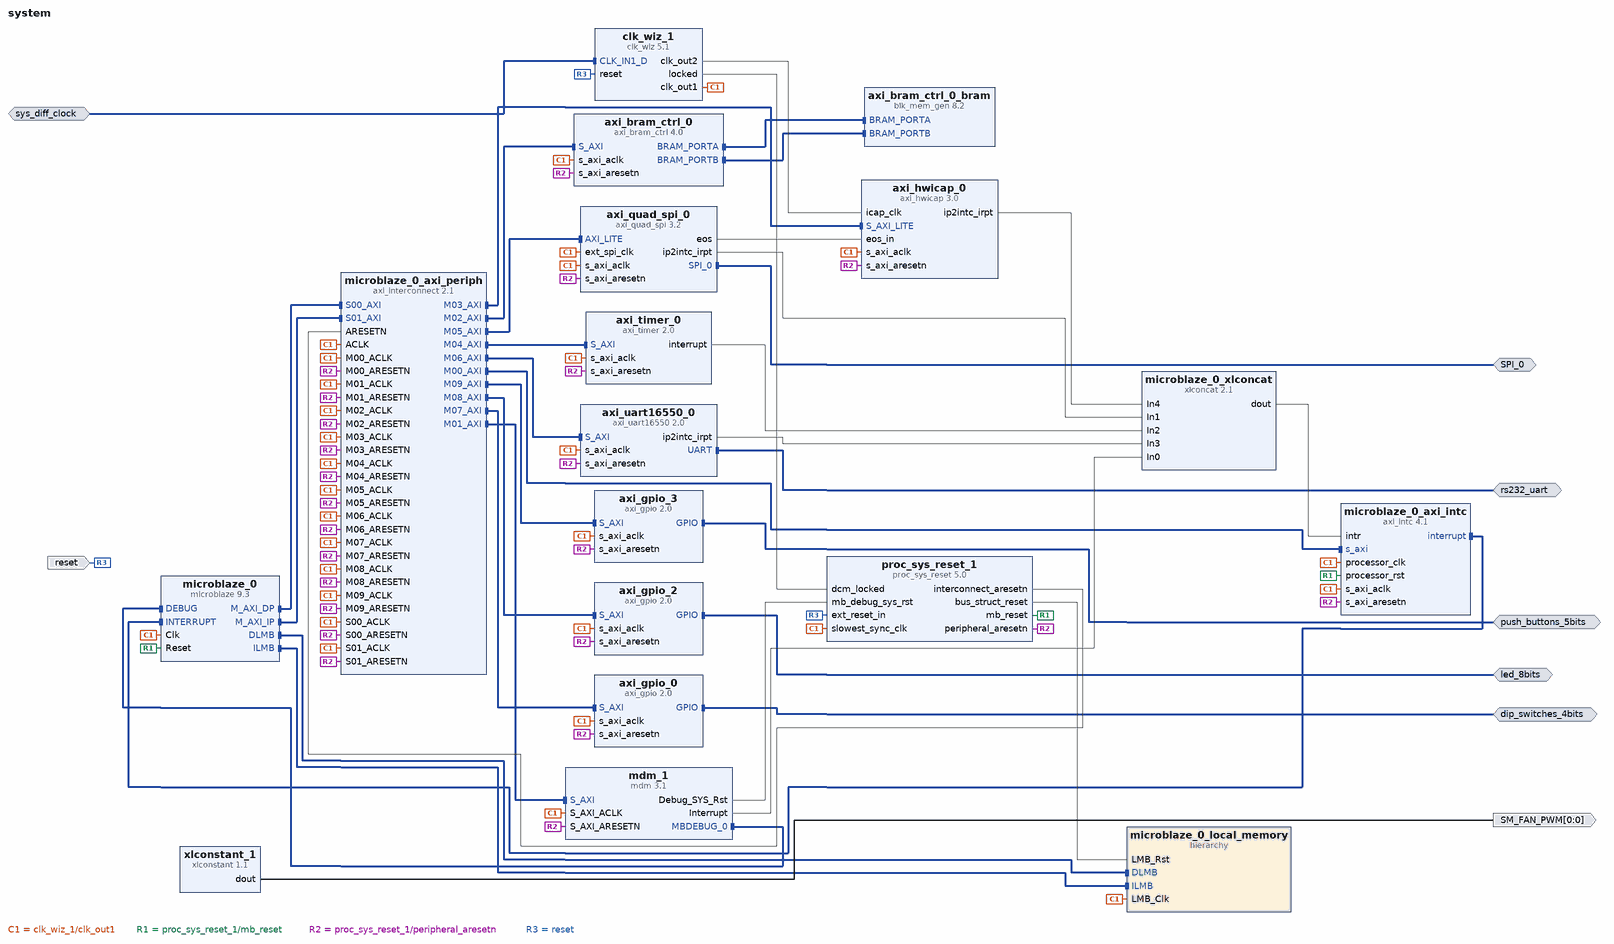
[diagram p0: block diagram of the top level]
# Vivado block design system, Vivado 2014.2
create_bd_design system

create_bd_intf_port -mode Master -vlnv xilinx.com:interface:spi_rtl:1.0 SPI_0
create_bd_intf_port -mode Master -vlnv xilinx.com:interface:gpio_rtl:1.0 dip_switches_4bits
create_bd_intf_port -mode Master -vlnv xilinx.com:interface:gpio_rtl:1.0 led_8bits
create_bd_intf_port -mode Master -vlnv xilinx.com:interface:gpio_rtl:1.0 push_buttons_5bits
create_bd_intf_port -mode Master -vlnv xilinx.com:interface:uart_rtl:1.0 rs232_uart
create_bd_intf_port -mode Slave -vlnv xilinx.com:interface:diff_clock_rtl:1.0 sys_diff_clock
set_property -dict {CONFIG.FREQ_HZ 200000000} [get_bd_intf_ports sys_diff_clock]
create_bd_port -dir I -type rst reset
set_property -dict {CONFIG.POLARITY ACTIVE_HIGH} [get_bd_ports reset]
create_bd_port -dir O -from 0 -to 0 SM_FAN_PWM

create_bd_cell -type ip -vlnv xilinx.com:ip:axi_bram_ctrl:4.0 axi_bram_ctrl_0
create_bd_cell -type ip -vlnv xilinx.com:ip:blk_mem_gen:8.2 axi_bram_ctrl_0_bram
set_property -dict {CONFIG.Memory_Type True_Dual_Port_RAM} [get_bd_cells axi_bram_ctrl_0_bram]
create_bd_cell -type ip -vlnv xilinx.com:ip:axi_gpio:2.0 axi_gpio_0
set_property -dict {CONFIG.USE_BOARD_FLOW true CONFIG.GPIO_BOARD_INTERFACE dip_switches_4bits} [get_bd_cells axi_gpio_0]
create_bd_cell -type ip -vlnv xilinx.com:ip:axi_gpio:2.0 axi_gpio_2
set_property -dict {CONFIG.USE_BOARD_FLOW true CONFIG.GPIO_BOARD_INTERFACE led_8bits} [get_bd_cells axi_gpio_2]
create_bd_cell -type ip -vlnv xilinx.com:ip:axi_gpio:2.0 axi_gpio_3
set_property -dict {CONFIG.USE_BOARD_FLOW true CONFIG.GPIO_BOARD_INTERFACE push_buttons_5bits} [get_bd_cells axi_gpio_3]
create_bd_cell -type ip -vlnv xilinx.com:ip:axi_hwicap:3.0 axi_hwicap_0
set_property -dict {CONFIG.C_INCLUDE_STARTUP 0} [get_bd_cells axi_hwicap_0]
create_bd_cell -type ip -vlnv xilinx.com:ip:axi_quad_spi:3.2 axi_quad_spi_0
set_property -dict [list \
  CONFIG.C_SPI_MODE 2 \
  CONFIG.C_XIP_MODE 0 \
  CONFIG.USE_BOARD_FLOW true \
  CONFIG.QSPI_BOARD_INTERFACE spi_flash \
] [get_bd_cells axi_quad_spi_0]
create_bd_cell -type ip -vlnv xilinx.com:ip:axi_timer:2.0 axi_timer_0
create_bd_cell -type ip -vlnv xilinx.com:ip:axi_uart16550:2.0 axi_uart16550_0
set_property -dict {CONFIG.USE_BOARD_FLOW true CONFIG.UART_BOARD_INTERFACE rs232_uart} [get_bd_cells axi_uart16550_0]
create_bd_cell -type ip -vlnv xilinx.com:ip:clk_wiz:5.1 clk_wiz_1
set_property -dict [list \
  CONFIG.CLKOUT2_USED true \
  CONFIG.CLKOUT2_REQUESTED_OUT_FREQ 50.000 \
  CONFIG.USE_BOARD_FLOW true \
  CONFIG.DIFF_CLK_IN1_BOARD_INTERFACE sys_diff_clock \
  CONFIG.RESET_BOARD_INTERFACE reset \
] [get_bd_cells clk_wiz_1]
create_bd_cell -type ip -vlnv xilinx.com:ip:mdm:3.1 mdm_1
set_property -dict {CONFIG.C_USE_UART 1} [get_bd_cells mdm_1]
create_bd_cell -type ip -vlnv xilinx.com:ip:microblaze:9.3 microblaze_0
set_property -dict [list \
  CONFIG.C_FAULT_TOLERANT 0 \
  CONFIG.C_D_AXI 1 \
  CONFIG.C_D_LMB 1 \
  CONFIG.C_I_AXI 1 \
  CONFIG.C_I_LMB 1 \
  CONFIG.C_USE_BARREL 1 \
  CONFIG.C_DEBUG_ENABLED 1 \
  CONFIG.C_USE_INTERRUPT 2 \
] [get_bd_cells microblaze_0]
create_bd_cell -type ip -vlnv xilinx.com:ip:axi_intc:4.1 microblaze_0_axi_intc
set_property -dict {CONFIG.C_HAS_FAST 1} [get_bd_cells microblaze_0_axi_intc]
create_bd_cell -type ip -vlnv xilinx.com:ip:axi_interconnect:2.1 microblaze_0_axi_periph
set_property -dict {CONFIG.NUM_SI 2 CONFIG.NUM_MI 10} [get_bd_cells microblaze_0_axi_periph]
create_bd_cell -type hier microblaze_0_local_memory
create_bd_cell -type ip -vlnv xilinx.com:ip:xlconcat:2.1 microblaze_0_xlconcat
set_property -dict {CONFIG.NUM_PORTS 5} [get_bd_cells microblaze_0_xlconcat]
create_bd_cell -type ip -vlnv xilinx.com:ip:proc_sys_reset:5.0 proc_sys_reset_1
set_property -dict {CONFIG.USE_BOARD_FLOW true CONFIG.RESET_BOARD_INTERFACE reset} [get_bd_cells proc_sys_reset_1]
create_bd_cell -type ip -vlnv xilinx.com:ip:xlconstant:1.1 xlconstant_1

# ---- hierarchy /microblaze_0_local_memory ----
current_bd_instance /microblaze_0_local_memory
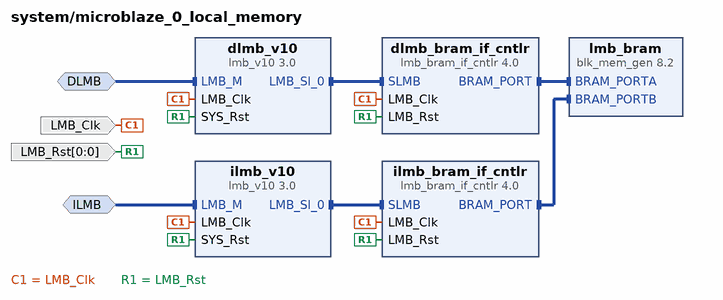
[diagram p1: block diagram inside /microblaze_0_local_memory]
create_bd_intf_pin -mode MirroredMaster -vlnv xilinx.com:interface:lmb_rtl:1.0 DLMB
create_bd_intf_pin -mode MirroredMaster -vlnv xilinx.com:interface:lmb_rtl:1.0 ILMB
create_bd_pin -dir I LMB_Clk
create_bd_pin -dir I -from 0 -to 0 LMB_Rst

create_bd_cell -type ip -vlnv xilinx.com:ip:lmb_bram_if_cntlr:4.0 dlmb_bram_if_cntlr
set_property -dict {CONFIG.C_ECC 0} [get_bd_cells dlmb_bram_if_cntlr]
create_bd_cell -type ip -vlnv xilinx.com:ip:lmb_v10:3.0 dlmb_v10
create_bd_cell -type ip -vlnv xilinx.com:ip:lmb_bram_if_cntlr:4.0 ilmb_bram_if_cntlr
set_property -dict {CONFIG.C_ECC 0} [get_bd_cells ilmb_bram_if_cntlr]
create_bd_cell -type ip -vlnv xilinx.com:ip:lmb_v10:3.0 ilmb_v10
create_bd_cell -type ip -vlnv xilinx.com:ip:blk_mem_gen:8.2 lmb_bram
set_property -dict {CONFIG.Memory_Type True_Dual_Port_RAM CONFIG.use_bram_block BRAM_Controller} [get_bd_cells lmb_bram]

# ---- connections ----

current_bd_instance /microblaze_0_local_memory
connect_bd_intf_net -intf_net microblaze_0_dlmb_bus [get_bd_intf_pins dlmb_bram_if_cntlr/SLMB] [get_bd_intf_pins dlmb_v10/LMB_Sl_0]
connect_bd_intf_net -intf_net microblaze_0_dlmb_cntlr [get_bd_intf_pins dlmb_bram_if_cntlr/BRAM_PORT] [get_bd_intf_pins lmb_bram/BRAM_PORTA]
connect_bd_intf_net -intf_net microblaze_0_ilmb_bus [get_bd_intf_pins ilmb_bram_if_cntlr/SLMB] [get_bd_intf_pins ilmb_v10/LMB_Sl_0]
connect_bd_intf_net -intf_net microblaze_0_ilmb_cntlr [get_bd_intf_pins ilmb_bram_if_cntlr/BRAM_PORT] [get_bd_intf_pins lmb_bram/BRAM_PORTB]
connect_bd_intf_net -intf_net microblaze_0_dlmb [get_bd_intf_pins DLMB] [get_bd_intf_pins dlmb_v10/LMB_M]
connect_bd_intf_net -intf_net microblaze_0_ilmb [get_bd_intf_pins ILMB] [get_bd_intf_pins ilmb_v10/LMB_M]
connect_bd_net -net microblaze_0_Clk [get_bd_pins LMB_Clk] \
  [get_bd_pins dlmb_bram_if_cntlr/LMB_Clk] [get_bd_pins dlmb_v10/LMB_Clk] [get_bd_pins ilmb_bram_if_cntlr/LMB_Clk] \
  [get_bd_pins ilmb_v10/LMB_Clk]
connect_bd_net -net proc_sys_reset_1_bus_struct_reset [get_bd_pins LMB_Rst] \
  [get_bd_pins dlmb_bram_if_cntlr/LMB_Rst] [get_bd_pins dlmb_v10/SYS_Rst] [get_bd_pins ilmb_bram_if_cntlr/LMB_Rst] \
  [get_bd_pins ilmb_v10/SYS_Rst]

current_bd_instance /
connect_bd_intf_net [get_bd_intf_pins axi_bram_ctrl_0/BRAM_PORTA] [get_bd_intf_pins axi_bram_ctrl_0_bram/BRAM_PORTA]
connect_bd_intf_net [get_bd_intf_pins axi_bram_ctrl_0/BRAM_PORTB] [get_bd_intf_pins axi_bram_ctrl_0_bram/BRAM_PORTB]
connect_bd_intf_net [get_bd_intf_pins microblaze_0_axi_intc/s_axi] [get_bd_intf_pins microblaze_0_axi_periph/M00_AXI]
connect_bd_intf_net [get_bd_intf_pins mdm_1/S_AXI] [get_bd_intf_pins microblaze_0_axi_periph/M01_AXI]
connect_bd_intf_net [get_bd_intf_pins axi_bram_ctrl_0/S_AXI] [get_bd_intf_pins microblaze_0_axi_periph/M02_AXI]
connect_bd_intf_net [get_bd_intf_pins axi_hwicap_0/S_AXI_LITE] [get_bd_intf_pins microblaze_0_axi_periph/M03_AXI]
connect_bd_intf_net [get_bd_intf_pins axi_timer_0/S_AXI] [get_bd_intf_pins microblaze_0_axi_periph/M04_AXI]
connect_bd_intf_net [get_bd_intf_pins axi_quad_spi_0/AXI_LITE] [get_bd_intf_pins microblaze_0_axi_periph/M05_AXI]
connect_bd_intf_net [get_bd_intf_pins axi_uart16550_0/S_AXI] [get_bd_intf_pins microblaze_0_axi_periph/M06_AXI]
connect_bd_intf_net [get_bd_intf_pins axi_gpio_0/S_AXI] [get_bd_intf_pins microblaze_0_axi_periph/M07_AXI]
connect_bd_intf_net [get_bd_intf_pins axi_gpio_2/S_AXI] [get_bd_intf_pins microblaze_0_axi_periph/M08_AXI]
connect_bd_intf_net [get_bd_intf_pins axi_gpio_3/S_AXI] [get_bd_intf_pins microblaze_0_axi_periph/M09_AXI]
connect_bd_intf_net [get_bd_intf_pins mdm_1/MBDEBUG_0] [get_bd_intf_pins microblaze_0/DEBUG]
connect_bd_intf_net [get_bd_intf_pins microblaze_0/DLMB] [get_bd_intf_pins microblaze_0_local_memory/DLMB]
connect_bd_intf_net [get_bd_intf_pins microblaze_0/ILMB] [get_bd_intf_pins microblaze_0_local_memory/ILMB]
connect_bd_intf_net [get_bd_intf_pins microblaze_0/INTERRUPT] [get_bd_intf_pins microblaze_0_axi_intc/interrupt]
connect_bd_intf_net [get_bd_intf_pins microblaze_0/M_AXI_DP] [get_bd_intf_pins microblaze_0_axi_periph/S00_AXI]
connect_bd_intf_net [get_bd_intf_pins microblaze_0/M_AXI_IP] [get_bd_intf_pins microblaze_0_axi_periph/S01_AXI]
connect_bd_intf_net [get_bd_intf_ports SPI_0] [get_bd_intf_pins axi_quad_spi_0/SPI_0]
connect_bd_intf_net [get_bd_intf_ports dip_switches_4bits] [get_bd_intf_pins axi_gpio_0/GPIO]
connect_bd_intf_net [get_bd_intf_ports led_8bits] [get_bd_intf_pins axi_gpio_2/GPIO]
connect_bd_intf_net [get_bd_intf_ports push_buttons_5bits] [get_bd_intf_pins axi_gpio_3/GPIO]
connect_bd_intf_net [get_bd_intf_ports rs232_uart] [get_bd_intf_pins axi_uart16550_0/UART]
connect_bd_intf_net [get_bd_intf_ports sys_diff_clock] [get_bd_intf_pins clk_wiz_1/CLK_IN1_D]
connect_bd_net [get_bd_pins axi_hwicap_0/ip2intc_irpt] [get_bd_pins microblaze_0_xlconcat/In4]
connect_bd_net [get_bd_pins axi_quad_spi_0/eos] [get_bd_pins axi_hwicap_0/eos_in]
connect_bd_net [get_bd_pins axi_quad_spi_0/ip2intc_irpt] [get_bd_pins microblaze_0_xlconcat/In1]
connect_bd_net [get_bd_pins axi_timer_0/interrupt] [get_bd_pins microblaze_0_xlconcat/In2]
connect_bd_net [get_bd_pins axi_uart16550_0/ip2intc_irpt] [get_bd_pins microblaze_0_xlconcat/In3]
connect_bd_net [get_bd_pins clk_wiz_1/clk_out2] [get_bd_pins axi_hwicap_0/icap_clk]
connect_bd_net [get_bd_pins clk_wiz_1/locked] [get_bd_pins proc_sys_reset_1/dcm_locked]
connect_bd_net [get_bd_pins mdm_1/Debug_SYS_Rst] [get_bd_pins proc_sys_reset_1/mb_debug_sys_rst]
connect_bd_net [get_bd_pins mdm_1/Interrupt] [get_bd_pins microblaze_0_xlconcat/In0]
connect_bd_net -net microblaze_0_Clk [get_bd_pins clk_wiz_1/clk_out1] \
  [get_bd_pins axi_bram_ctrl_0/s_axi_aclk] [get_bd_pins axi_gpio_0/s_axi_aclk] [get_bd_pins axi_gpio_2/s_axi_aclk] \
  [get_bd_pins axi_gpio_3/s_axi_aclk] [get_bd_pins axi_hwicap_0/s_axi_aclk] [get_bd_pins axi_quad_spi_0/ext_spi_clk] \
  [get_bd_pins axi_quad_spi_0/s_axi_aclk] [get_bd_pins axi_timer_0/s_axi_aclk] [get_bd_pins axi_uart16550_0/s_axi_aclk] \
  [get_bd_pins mdm_1/S_AXI_ACLK] [get_bd_pins microblaze_0/Clk] [get_bd_pins microblaze_0_axi_intc/processor_clk] \
  [get_bd_pins microblaze_0_axi_intc/s_axi_aclk] [get_bd_pins microblaze_0_axi_periph/ACLK] \
  [get_bd_pins microblaze_0_axi_periph/M00_ACLK] [get_bd_pins microblaze_0_axi_periph/M01_ACLK] \
  [get_bd_pins microblaze_0_axi_periph/M02_ACLK] [get_bd_pins microblaze_0_axi_periph/M03_ACLK] \
  [get_bd_pins microblaze_0_axi_periph/M04_ACLK] [get_bd_pins microblaze_0_axi_periph/M05_ACLK] \
  [get_bd_pins microblaze_0_axi_periph/M06_ACLK] [get_bd_pins microblaze_0_axi_periph/M07_ACLK] \
  [get_bd_pins microblaze_0_axi_periph/M08_ACLK] [get_bd_pins microblaze_0_axi_periph/M09_ACLK] \
  [get_bd_pins microblaze_0_axi_periph/S00_ACLK] [get_bd_pins microblaze_0_axi_periph/S01_ACLK] \
  [get_bd_pins microblaze_0_local_memory/LMB_Clk] [get_bd_pins proc_sys_reset_1/slowest_sync_clk]
connect_bd_net -net microblaze_0_intr [get_bd_pins microblaze_0_xlconcat/dout] [get_bd_pins microblaze_0_axi_intc/intr]
connect_bd_net [get_bd_pins proc_sys_reset_1/bus_struct_reset] [get_bd_pins microblaze_0_local_memory/LMB_Rst]
connect_bd_net [get_bd_pins proc_sys_reset_1/interconnect_aresetn] [get_bd_pins microblaze_0_axi_periph/ARESETN]
connect_bd_net [get_bd_pins proc_sys_reset_1/mb_reset] [get_bd_pins microblaze_0/Reset] [get_bd_pins microblaze_0_axi_intc/processor_rst]
connect_bd_net [get_bd_pins proc_sys_reset_1/peripheral_aresetn] \
  [get_bd_pins axi_bram_ctrl_0/s_axi_aresetn] [get_bd_pins axi_gpio_0/s_axi_aresetn] [get_bd_pins axi_gpio_2/s_axi_aresetn] \
  [get_bd_pins axi_gpio_3/s_axi_aresetn] [get_bd_pins axi_hwicap_0/s_axi_aresetn] [get_bd_pins axi_quad_spi_0/s_axi_aresetn] \
  [get_bd_pins axi_timer_0/s_axi_aresetn] [get_bd_pins axi_uart16550_0/s_axi_aresetn] [get_bd_pins mdm_1/S_AXI_ARESETN] \
  [get_bd_pins microblaze_0_axi_intc/s_axi_aresetn] [get_bd_pins microblaze_0_axi_periph/M00_ARESETN] \
  [get_bd_pins microblaze_0_axi_periph/M01_ARESETN] [get_bd_pins microblaze_0_axi_periph/M02_ARESETN] \
  [get_bd_pins microblaze_0_axi_periph/M03_ARESETN] [get_bd_pins microblaze_0_axi_periph/M04_ARESETN] \
  [get_bd_pins microblaze_0_axi_periph/M05_ARESETN] [get_bd_pins microblaze_0_axi_periph/M06_ARESETN] \
  [get_bd_pins microblaze_0_axi_periph/M07_ARESETN] [get_bd_pins microblaze_0_axi_periph/M08_ARESETN] \
  [get_bd_pins microblaze_0_axi_periph/M09_ARESETN] [get_bd_pins microblaze_0_axi_periph/S00_ARESETN] \
  [get_bd_pins microblaze_0_axi_periph/S01_ARESETN]
connect_bd_net [get_bd_ports reset] [get_bd_pins clk_wiz_1/reset] [get_bd_pins proc_sys_reset_1/ext_reset_in]
connect_bd_net -net xlconstant_1_const [get_bd_pins xlconstant_1/dout] [get_bd_ports SM_FAN_PWM]

# ---- address map ----
assign_bd_address -offset 0x00000000 -range 8K -target_address_space [get_bd_addr_spaces microblaze_0/Data] [get_bd_addr_segs microblaze_0_local_memory/dlmb_bram_if_cntlr/SLMB/Mem]
assign_bd_address -offset 0x40000000 -range 64K -target_address_space [get_bd_addr_spaces microblaze_0/Data] [get_bd_addr_segs axi_gpio_0/S_AXI/Reg]
assign_bd_address -offset 0x40010000 -range 64K -target_address_space [get_bd_addr_spaces microblaze_0/Data] [get_bd_addr_segs axi_gpio_2/S_AXI/Reg]
assign_bd_address -offset 0x40020000 -range 64K -target_address_space [get_bd_addr_spaces microblaze_0/Data] [get_bd_addr_segs axi_gpio_3/S_AXI/Reg]
assign_bd_address -offset 0x40200000 -range 64K -target_address_space [get_bd_addr_spaces microblaze_0/Data] [get_bd_addr_segs axi_hwicap_0/S_AXI_LITE/Reg]
assign_bd_address -offset 0x40400000 -range 8K -target_address_space [get_bd_addr_spaces microblaze_0/Data] [get_bd_addr_segs axi_uart16550_0/S_AXI/Reg]
assign_bd_address -offset 0x41200000 -range 64K -target_address_space [get_bd_addr_spaces microblaze_0/Data] [get_bd_addr_segs microblaze_0_axi_intc/s_axi/Reg]
assign_bd_address -offset 0x41400000 -range 4K -target_address_space [get_bd_addr_spaces microblaze_0/Data] [get_bd_addr_segs mdm_1/S_AXI/Reg]
assign_bd_address -offset 0x41C00000 -range 64K -target_address_space [get_bd_addr_spaces microblaze_0/Data] [get_bd_addr_segs axi_timer_0/S_AXI/Reg]
assign_bd_address -offset 0x44A00000 -range 64K -target_address_space [get_bd_addr_spaces microblaze_0/Data] [get_bd_addr_segs axi_quad_spi_0/AXI_LITE/Reg]
assign_bd_address -offset 0xC0000000 -range 128K -target_address_space [get_bd_addr_spaces microblaze_0/Data] [get_bd_addr_segs axi_bram_ctrl_0/S_AXI/Mem0]
assign_bd_address -offset 0x00000000 -range 8K -target_address_space [get_bd_addr_spaces microblaze_0/Instruction] [get_bd_addr_segs microblaze_0_local_memory/ilmb_bram_if_cntlr/SLMB/Mem]
assign_bd_address -offset 0x40000000 -range 64K -target_address_space [get_bd_addr_spaces microblaze_0/Instruction] [get_bd_addr_segs axi_gpio_0/S_AXI/Reg]
assign_bd_address -offset 0x40010000 -range 64K -target_address_space [get_bd_addr_spaces microblaze_0/Instruction] [get_bd_addr_segs axi_gpio_2/S_AXI/Reg]
assign_bd_address -offset 0x40020000 -range 64K -target_address_space [get_bd_addr_spaces microblaze_0/Instruction] [get_bd_addr_segs axi_gpio_3/S_AXI/Reg]
assign_bd_address -offset 0x40200000 -range 64K -target_address_space [get_bd_addr_spaces microblaze_0/Instruction] [get_bd_addr_segs axi_hwicap_0/S_AXI_LITE/Reg]
assign_bd_address -offset 0x40400000 -range 8K -target_address_space [get_bd_addr_spaces microblaze_0/Instruction] [get_bd_addr_segs axi_uart16550_0/S_AXI/Reg]
assign_bd_address -offset 0x41200000 -range 64K -target_address_space [get_bd_addr_spaces microblaze_0/Instruction] [get_bd_addr_segs microblaze_0_axi_intc/s_axi/Reg]
assign_bd_address -offset 0x41400000 -range 4K -target_address_space [get_bd_addr_spaces microblaze_0/Instruction] [get_bd_addr_segs mdm_1/S_AXI/Reg]
assign_bd_address -offset 0x41C00000 -range 64K -target_address_space [get_bd_addr_spaces microblaze_0/Instruction] [get_bd_addr_segs axi_timer_0/S_AXI/Reg]
assign_bd_address -offset 0x44A00000 -range 64K -target_address_space [get_bd_addr_spaces microblaze_0/Instruction] [get_bd_addr_segs axi_quad_spi_0/AXI_LITE/Reg]
assign_bd_address -offset 0xC0000000 -range 128K -target_address_space [get_bd_addr_spaces microblaze_0/Instruction] [get_bd_addr_segs axi_bram_ctrl_0/S_AXI/Mem0]

validate_bd_design
save_bd_design
